# Altium schematic sheet Connectors.SchDoc: Sample Sheet Title
size B; Date: MM/DD/YYYY; Author: Sample Author; Organization: ORGANIZATION; Address1: ADDRESS 1; Address2: ADDRESS 2; Address3: ADDRESS 3; Address4: ADDRESS 4; Revision: -; SheetNumber: 1; SheetTotal: 2; ENG_APP_DATE: --/--/--; DSN_APP_DATE: --/--/--; CHK_APP_DATE: --/--/--
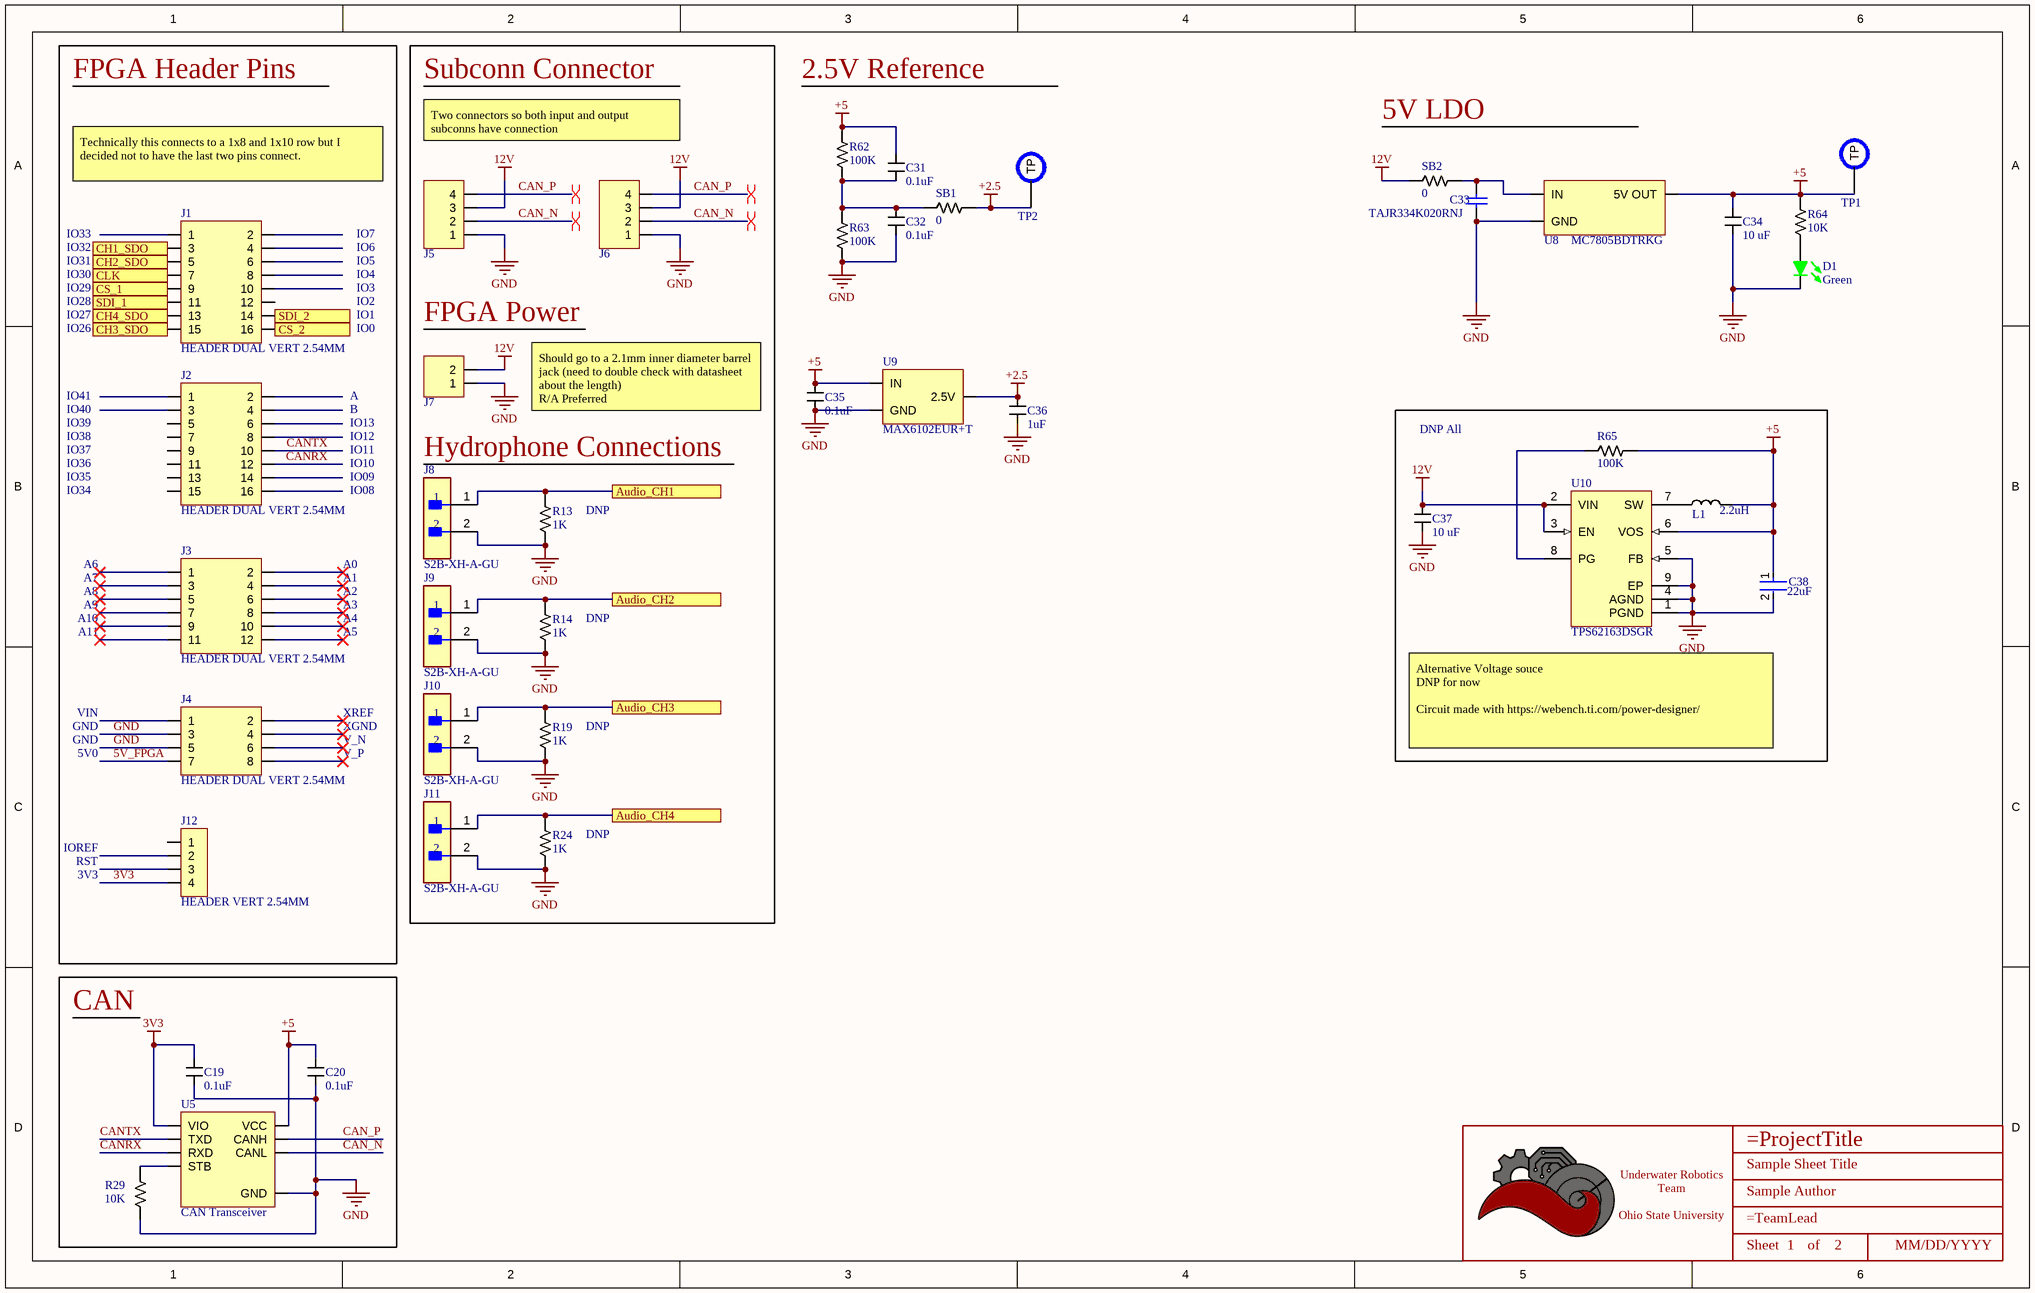
[diagram p0: Connectors.SchDoc]

## Parts
*  Title_Block  [LOGO]  (value not drawn)  (graphical)
C19  value 0.1uF  [CAPACITOR_0402]  (hidden comment: 100nF Ceramic 25V)
C20  value 0.1uF  [CAPACITOR_0402]  (hidden comment: 100nF Ceramic 25V)
C31  value 0.1uF  [CAPACITOR_0603]  (hidden comment: 100nF Ceramic 6.3V)
C32  value 0.1uF  [CAPACITOR_0603]  (hidden comment: 100nF Ceramic 6.3V)
C33  TAJR334K020RNJ  [CAPC2113X120X50NL20T30]
C34  Value (uF): 10 uF  [CAPACITOR_0603]  (hidden comment: 10uF Ceramic 6.3V)
C35  value 0.1uF  [CAPACITOR_0603]  (hidden comment: 100nF Ceramic 25V)
C36  value 1uF  [CAPACITOR_0603]  (hidden comment: 1uF Ceramic 16V)
C37  Value (uF): 10 uF  [CAPACITOR_1206]  (hidden comment: 10uF Ceramic 25V)
C38  Capacitance: 22uF  [FP-GRM31C-0_2-e0_3_0_8-MFG]  (hidden comment: GRM31CR71A226KE15L)
D1  Color: Green  [LED_0603]  (hidden comment: 150060GS75000)
J1  HEADER DUAL VERT 2.54MM  [HEADER_2x8PIN_2.54mm]
J2  HEADER DUAL VERT 2.54MM  [HEADER_2x8PIN_2.54mm]
J3  HEADER DUAL VERT 2.54MM  [HEADER_2x6PIN_2.54mm]
J4  HEADER DUAL VERT 2.54MM  [HEADER_2x4PIN_2.54mm]
J5  Microfit+ R/A  [CONN_MOLEX_MICROFIT+_4_POS_R/A - duplicate]  (value not drawn)
J6  Microfit+ R/A  [CONN_MOLEX_MICROFIT+_4_POS_R/A - duplicate]  (value not drawn)
J7  Microfit+ R/A  [CONN_MOLEX_MICROFIT+_2Flat_POS_R/A]  (value not drawn)
J8  S2B-XH-A-GU  [FP-S2B-XH-A-GU-MFG]
J9  S2B-XH-A-GU  [FP-S2B-XH-A-GU-MFG]
J10  S2B-XH-A-GU  [FP-S2B-XH-A-GU-MFG]
J11  S2B-XH-A-GU  [FP-S2B-XH-A-GU-MFG]
J12  HEADER VERT 2.54MM  [HEADER_4PIN_2.54MM]
L1  value 2.2uH  [PA4332.222NLT]  (hidden comment: 2.2uH Shielded)
R13  Value  (Ohms): 1K  [RESISTOR_0402]  (hidden comment: 1k Ohm 1% 1/16W)
R14  Value  (Ohms): 1K  [RESISTOR_0402]  (hidden comment: 1k Ohm 1% 1/16W)
R19  Value  (Ohms): 1K  [RESISTOR_0402]  (hidden comment: 1k Ohm 1% 1/16W)
R24  Value  (Ohms): 1K  [RESISTOR_0402]  (hidden comment: 1k Ohm 1% 1/16W)
R29  Value  (Ohms): 10K  [RESISTOR_0402]  (hidden comment: 10k Ohm 1% 1/16W)
R62  Value  (Ohms): 100K  [RESISTOR_0603]  (hidden comment: 100k Ohm 0.5% 1/10W)
R63  Value  (Ohms): 100K  [RESISTOR_0603]  (hidden comment: 100k Ohm 0.5% 1/10W)
R64  Value  (Ohms): 10K  [RESISTOR_0603]  (hidden comment: 10k Ohm 5% 1/10W)
R65  Value  (Ohms): 100K  [RESISTOR_0402]  (hidden comment: 100k Ohm 1% 1/16W)
SB1  Value  (Ohms): 0  [RESISTOR_0603]  (hidden comment: 0 Ohm Jumper No Fit)
SB2  value 0  [RESISTOR_1206]  (hidden comment: JUMPER_0_1206)
TP1  PCB Test Point  [TESTPOINT_1.2MM]  (value not drawn)  (no BOM)
TP2  PCB Test Point  [TESTPOINT_1.2MM]  (value not drawn)  (no BOM)
U5  CAN Transceiver  [SOIC-8]
U8  MC7805BDTRKG  [DPAK-2]
U9  MAX6102EUR+T  [SOT-23-3]
U10  TPS62163DSGR  [DSG0008A_V]

## Blocks framed on the sheet
FPGA Header Pins: J1-J4 J12
DNP All: C37 C38 L1 R65 U10
CAN: C19 C20 R29 U5

## Ports
Audio_CH1, Audio_CH2, Audio_CH3, Audio_CH4, CH1_SDO, CH2_SDO, CH3_SDO, CH4_SDO, CLK, CS_1, CS_2, SDI_1, SDI_2

## Nets
3V3: C19.1 J12.4 U5.5(VIO)
12V: C37.1 J5.3 J6.3 J7.2 SB2.2 U10.2(VIN) U10.3(EN)
+2.5: C36.1 SB1.1 TP2.TP U9.2(2.5V)
+5: C20.1 C31.1 C34.1 C35.1 C38.1 L1.1 R62.1 R64.1 R65.1 TP1.TP U5.3(VCC) U8.3(5V_OUT) U9.1(IN) U10.6(VOS)
GND: C19.2 C20.2 C32.2 C33.1 C34.2 C35.2 C36.2 C37.2 C38.2 D1.2 J4.3 J4.5 J5.1 J6.1 J7.1 J8.2 J9.2 J10.2 J11.2 R13.2 R14.2 R19.2 R24.2 R29.2 R63.2 U5.2(GND) U8.2(GND) U9.3(GND) U10.1(PGND) U10.4(AGND) U10.5(FB) U10.9(EP)
5V_FPGA: J4.7
Audio_CH1: J8.1 R13.1 ; port Audio_CH1
Audio_CH2: J9.1 R14.1 ; port Audio_CH2
Audio_CH3: J10.1 R19.1 ; port Audio_CH3
Audio_CH4: J11.1 R24.1 ; port Audio_CH4
CAN_N: J5.2 J6.2 U5.6(CANL)
CAN_P: J5.4 J6.4 U5.7(CANH)
CANRX: J2.12 U5.4(RXD)
CANTX: J2.10 U5.1(TXD)
CH1_SDO: J1.3 ; port CH1_SDO
CH2_SDO: J1.5 ; port CH2_SDO
CH3_SDO: J1.15 ; port CH3_SDO
CH4_SDO: J1.13 ; port CH4_SDO
CLK: J1.7 ; port CLK
CS_1: J1.9 ; port CS_1
CS_2: J1.16 ; port CS_2
SDI_1: J1.11 ; port SDI_1
SDI_2: J1.14 ; port SDI_2
NetC31_2: C31.2 C32.1 R62.2 R63.1 SB1.2
NetC33_2: C33.2 SB2.1 U8.1(IN)
NetD1_1: D1.1 R64.2
NetL1_2: L1.2 U10.7(SW)
NetR29_1: R29.1 U5.8(STB)
NetR65_2: R65.2 U10.8(PG)

Not connected (* = marked no-connect by the designer): J1 1 2 4 6 8 10 12; J2 1 2 3 4 5 6 7 8 9 11 13 14 15 16; J3 1* 2* 3* 4* 5* 6* 7* 8* 9* 10* 11* 12*; J4 1 2* 4* 6* 8*; J12 1 2 3

## Layout directives
differential pair: CAN_N, CAN_P

## Notes on the sheet
- Subconn Connector
- 2.5V Reference
- Two connectors so both input and output subconns have connection
- 5V LDO
- IO33
- Technically this connects to a 1x8 and 1x10 row but I decided not to have the last two pins connect.
- IO7
- IO29
- IO30
- IO31
- IO32
- IO6
- IO5
- IO4
- IO3
- IO26
- IO27
- IO28
- IO2
- IO1
- IO0
- FPGA Power
- IO41
- IO40
- IO39
- A
- B
- IO13
- Should go to a 2.1mm inner diameter barrel jack (need to double check with datasheet about the length)
  R/A Preferred
- IO38
- IO37
- IO36
- IO35
- IO34
- IO12
- IO11
- IO10
- IO09
- IO08
- Hydrophone Connections
- A6
- A0
- (near R13) DNP
- A7
- A8
- A9
- A10
- A11
- A1
- A2
- A3
- A4
- A5
- (near R14) DNP
- VIN
- GND
- 5V0
- XREF
- XGND
- V_N
- V_P
- (near R19) DNP
- Alternative Voltage souce
  DNP for now
  Circuit made with https://webench.ti.com/power-designer/
- (near R24) DNP
- IOREF
- RST
- 3V3
- DWG. NO.
- REV.
- SHT.
- THIS DOCUMENT AND THE DATA DISCLOSED HEREIN OR HEREWITH IS THE PROPERTY OF ALTIUM LIMITED AND MAY BE FREELY DISTRIBUTED IN WHOLE. NO RIGHTS ARE RESERVED OR EXPRESS OR IMPLIED WARANTEE GIVEN.
- REVISION
- DESCRIPTION
- DATE
- APPROVED
- ENG:
- APPROVALS
- PROJECT
- DSN:
- CHK:
- REFERENCE DOCUMENTS
- PROJECT REVISION:
- TITLE
- DOCUMENT REVISION:
- DESIGN ITEM:
- BOM:
- FAB DWG:
- PCB DWG:
- ASSY DWG:
- SCALE:
- SIZE
- CAGE CODE
- FILE NAME
- DWG NO.
- SHEET
- OF
- REV
- (in symbol Title_Block) Underwater Robotics Team / Ohio State University; Sheet; of

## Library data of the parts
* = Title_Block: UWRT Schematic Title Block Template / Created June 2021, Dylan Trainor
C19 C20 = CAPACITOR_0.1uF_0402: Cap 100nF 25V +/-10% / Ceramic 0402; Made By: Robert Pafford; Tolerance: +/- 10%; Voltage: 25V; Supplier 1: Digi-Key; Supplier Part Number 1: 478-7868-1-ND
C31 C32 = CAPACITOR_0.1uF_0603: Cap 100nF 6.3V +/-10% / Ceramic 0603; Made By: Flip B; ComponentLink1Description: Datsheet; ComponentLink1URL: https://www.mouser.com/datasheet/2/212/KEM_C1002_X7R_SMD-1102033.pdf; Tolerance: +/- 10%; Voltage: 6.3V; Supplier 1: Digi-Key; Supplier Part Number 1: 399-15351-1-ND
C33 = CMP-2007-04068-1: Manufacturer: AVX Interconnect / Elco; Part Number: TAJR334K020RNJ
C34 = CAPACITOR_10uF_0603: Cap 10uF 6.3V +/-20% / Ceramic 0603; Made By: Flip B; ComponentLink1Description: Digikey; ComponentLink1URL: https://www.digikey.com/en/products/detail/samsung-electro-mechanics/CL10A106MQ8NNNC/3886777; Supplier 1: Digi-Key; Supplier Part Number 1: 1276-1119-1-ND; Tolerance: +/- 20%; Voltage: 6.3V
C35 = CAPACITOR_0.1uF_0603_25V: Cap 100nF 25V +/-10% / Ceramic 0603; Voltage: 6.3V; Made By: Flip B; ComponentLink1Description: Datsheet; ComponentLink1URL: https://www.mouser.com/datasheet/2/212/KEM_C1002_X7R_SMD-1102033.pdf; Tolerance: +/- 10%; Supplier 1: Digikey; Supplier Part Number 1: 1276-1006-1-ND
C36 = CAPACITOR_1uF_0603: Cap 1uF 16V +/-10% / Ceramic 0603; Made By: Flip B; Tolerance: +/- 10%; Voltage: 16V; Supplier 1: Arrow Electronics; Supplier Part Number 1: C1608X7R1C105K080AC
C37 = CAPACITOR_10uF_1206: Cap 10uF 25V +/-10% / Ceramic 1206; Made By: Robert Pafford; Tolerance: +/- 10%; Voltage: 25V; Supplier 1: Digi-Key; Supplier Part Number 1: 1276-1804-6-ND
C38 = CMP-06035-003841-1: Chip Multilayer Ceramic Capacitors for General Purpose, 1206, 22uF, X7R, 15%, 10%, 10V; Height: 1.6mm; Width: 0.063inch; Min Operating Temperature: -55°C; Package Quantity: 1; Termination: SMD/SMT; Length: 3.2mm; Voltage Rating: 10V; Case/Package: 1206; Case Code (Imperial): 1206; Depth: 1.6mm; Dielectric: X7R; Voltage: 10V; Material: Ceramic; Tolerance: 10%; Voltage Rating (DC): 10V; Lead Free: Lead Free; Max Operating Temperature: 125°C; Case Code (Metric): 3216; Packaging: Tape and Reel; Thickness: 0.071inch; Radiation Hardening: No; REACH SVHC: No SVHC; Mount: Surface Mount
D1 = LED_Green_0603_3.2V: LED Green Vf= 3.2V If = 0.025A / 150060GS75000; Made By: Flip B; Forward Current: 25mA; Supplier 1: Digi-Key; ComponentLink1Description: Datasheet; ComponentLink1URL: https://www.we-online.de/katalog/datasheet/150060GS75000.pdf; Supplier Part Number 1: 732-4971-1-ND; Forward Voltage: 3.2V; Package: 0603
J1 J2 = HEADER_2x8PIN_2.54_1: CONN HEADER VERT 8POS 2.54MM; Pitch (mm): 2.54; Positions: 16; Created By: John Ulm; Supplier 1: DigiKey; Supplier Part Number 1: WM8144-ND
J3 = HEADER_2x6PIN_2.54: CONN HEADER VERT 6POS 2.54MM; Pitch (mm): 2.54; Positions: 12; Created By: John Ulm; Supplier 1: DigiKey; Supplier Part Number 1: 2057-PH2-12-UA-ND
J4 = HEADER_2x4PIN_2.54_1: CONN HEADER VERT 4POS 2.54MM; Pitch (mm): 2.54; Positions: 8; Created By: John Ulm; Supplier 1: RS (Formerly Allied Electronics); Supplier Part Number 1: PH2-08-UA
J5 J6 = CONN_MOLEX_MICROFIT+_4POS_R/A: Molex Microfit+ / 212528 4 POS R/A Black; Pitch: 3.0mm; Current Per Pin: 12.5A; Manufacturer: Molex; Supplier 1: Digikey; Supplier Part Number 1: 900-2125280400-ND; Configuration: R/A; Color: Black
J7 = CONN_MOLEX_MICROFIT+_2POS_Flat_R/A: Molex Microfit+ / 2157601002 2POS Right Angle; Pitch: 3.0mm; Current Per Pin: 12.5A; Manufacturer: Molex; Configuration: R/A; Color: Black; Supplier 1: DigiKey; Supplier Part Number 1: 900-2157601002-ND
J8-J11 = CMP-17439-000226-1: Conn Shrouded Header HDR 2 POS 2.45mm Solder ST Top Entry Thru-Hole; Lead Free: Lead Free
J12 = HEADER_4PIN_2.54MM: CONN HEADER VERT 4POS 2.54MM; Made By: Robert Pafford; Supplier 1: Digi-Key; Supplier Part Number 1: S1012E-04-ND
L1 = INDUCTOR_2.2uH: 2.2 µH Shielded Drum Core, Wirewound Inductor 4.3 A 48mOhm Max Nonstandard; Supplier 1: DigiKey; Supplier Part Number 1: 553-3290-1-ND
R13 R14 R19 R24 = RESISTOR_1K_0402: RES 1k OHM 1% 1/16W 0402; Tolerance: +/- 1%; Made By: Robert Pafford; Wattage: 1/16W; Supplier: Digikey; Digikey Part Numer: CR0603-JW-104ELFTR-ND; Supplier 1: Digi-Key; Supplier Part Number 1: 13-AC0402FR-131KLCT-ND
R29 = RESISTOR_10K_0402: RES 10k OHM 1% 1/16W 0402; Tolerance: +/- 1%; Made By: Robert Pafford; Wattage: 1/16W; Supplier: Digikey; Digikey Part Numer: CR0603-JW-104ELFTR-ND; Supplier 1: Digi-Key; Supplier Part Number 1: YAG3436CT-ND
R62 R63 = RESISTOR_100K_0.5%_0603: RES 100k OHM 0.5% 1/10W 0603; Tolerance: +/- 0.5%; Made By: John Ulm; ComponentLink1Description: Datasheet; ComponentLink1URL: https://www.bourns.com/docs/product-datasheets/CRxxxxx.pdf; Wattage: 1/10W; Supplier: Digikey; Digikey Part Numer: CR0603-JW-104ELFTR-ND; Supplier 1: Digi-Key; Supplier Part Number 1: 311-2395-1-ND
R64 = RESISTOR_10K_0603: RES 10k OHM 5% 1/10W 0603; Tolerance: +/- 5%; Wattage: 1/8W; Made By: Robert Pafford; ComponentLink1Description: Datasheet; ComponentLink1URL: https://www.bourns.com/docs/product-datasheets/CRxxxxx.pdf; Supplier: Digikey; Digikey Part Numer: CR0603-JW-104ELFTR-ND; Supplier 1: Digi-Key; Supplier Part Number 1: 2019-RK73B1JTTD103JCT-ND
R65 = RESISTOR_100K_0402: RES 100k OHM 1% 1/16W 0402; Tolerance: +/- 1%; Made By: Robert Pafford; Wattage: 1/16W; Supplier 1: Digikey; Supplier Part Number 1: YAG3434CT-ND
SB1 = JUMPER_0_0603: 0 Ohm Jumper No Fit for Solder Bridge; Made By: Robert Pafford; ComponentLink1Description: Digikey; ComponentLink1URL: https://www.digikey.com/en/products/detail/koa-speer-electronics-inc/RK73B1JTTD101J/9844701
SB2 = JUMPER_0_1206: JUMPER 0OHM 1206
TP1 TP2 = TESTPOINT: Made By: Robert Pafford
U5 = TJA1442AT: CAN Interface IC High-Speed CAN Transceiver with Standby Mode; Made By: Robert Pafford; Max Data Rate: 5Mbps; Supplier 1: Mouser; Supplier Part Number 1: 771-TJA1442AT/0Z
U8 = MC7805BDTRKG: Linear Voltage Regulator IC Positive Fixed 1 Output 1A DPAK
U9 = MAX6102EUR+T: Series Voltage Reference IC Fixed 2.5V V ±0.4% 5 mA SOT-23-3; Supplier 1: DigiKey; Supplier Part Number 1: MAX6102EUR+TCT-ND
U10 = CMP-0323-00318-3: Buck Step Down Regulator with 3 to 17 V Input and 5 V Output, -40 to 85 degC, 8-Pin WSON (DSG), Green (RoHS & no Sb/Br); Manufacturer: Texas Instruments; Synchronous Rectification: TRUE; Vout(Max)(V): 5; Iq(Typ)(mA): 0.017; Rating: Catalog; Switch Current Limit(Typ)(A): 1.8; Iout(Max)(A): 1; Vin(Max)(V): 17; Duty Cycle(Max)(%): 100; Vin(Min)(V): 3; SubFamily: Step-Down Regulator; PartNumber: TPS62163DSGR; PackageDescription: 8-Pin Plastic Small Outline No-Lead, 2 x 2 x 0.8 mm Body, 0.5 mm Pitch, Exposed Pad; PackageReference: DSG0008A; ComponentLink2Description: Package Specification; PackageVersion: revB, Oct-2010; ComponentLink1URL: http://www.ti.com/general/docs/lit/getliterature.tsp?genericPartNumber=TPS62163&fileType=pdf; ComponentLink2URL: http://www.ti.com/litv/pdf/mpds308a; DatasheetVersion: SLVSAM2A; Mounting Technology: Surface Mount; Eco-Plan: Green (RoHS & no Sb/Br); Code_JEDEC: MO-229; ComponentLink3Description: URL Link1; Topology: Buck; Regulated Outputs(#): 1; Preset Vout(V): 5; Vout(Min)(V): 5; ComponentLink1Description: Datasheet; ComponentLink3URL: Samples URL:http://www.ti.com/product/tps62163#samples